# Altium schematic sheet OSD19001_USB.SchDoc
size B; Organization: Altium Limited; DocumentNumber: 4; SheetNumber: 4; SheetTotal: 4; SchematicTitle: OSD32MP1 BREAKOUT MODULE (USB)
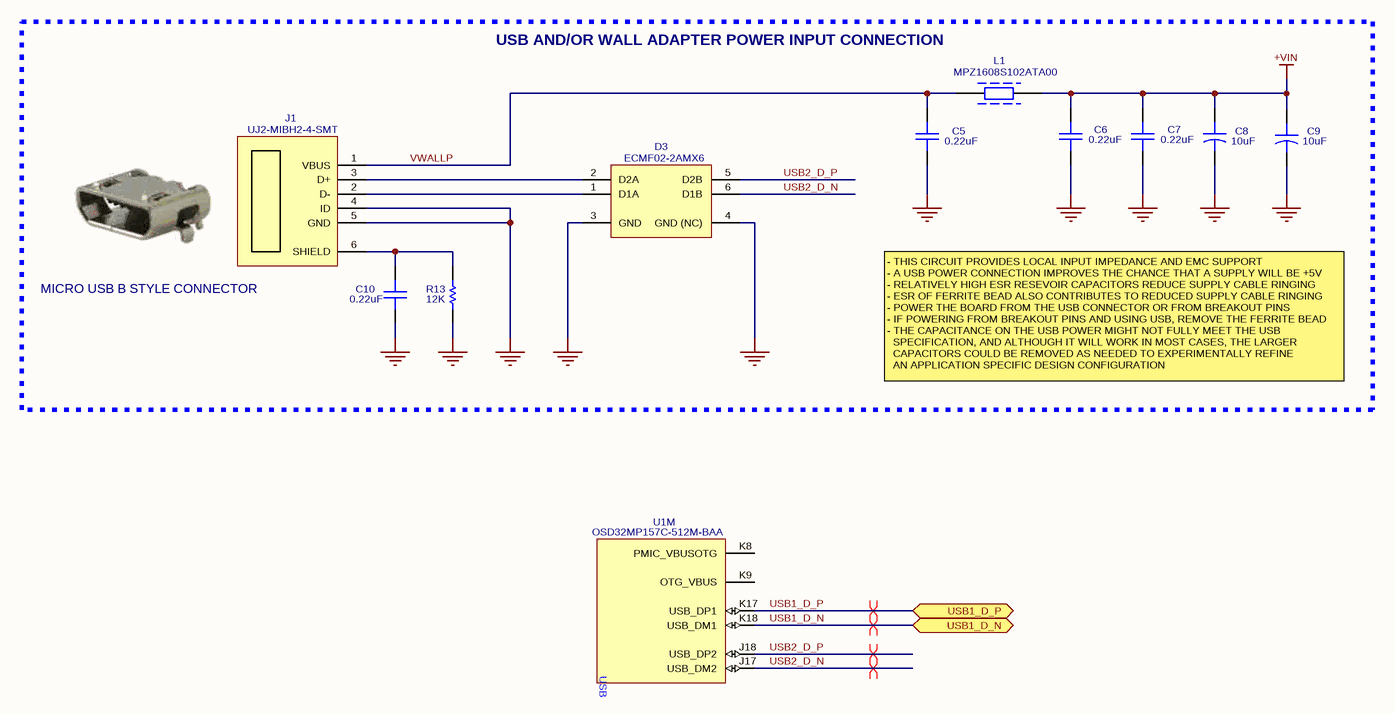
[diagram p0: OSD19001_USB.SchDoc]

## Parts
C5  0.22uF  [LP_0603_HIGH]
C6  0.22uF  [LP_0603_HIGH]
C7  0.22uF  [LP_0603_HIGH]
C8  10uF  [LP_EIAB]
C9  10uF  [LP_EIAB]
C10  0.22uF  [LP_0603_HIGH]
D3  ECMF02-2AMX6  [DFN6_6L_ST]
J1  UJ2-MIBH2-4-SMT  [CUI_UJ2-MIBH2-4-SMT]
L1  MPZ1608S102ATA00  [LP_0603_IND]
R13  12K  [LP_0603_LOW]
U1  OSD32MP157C-512M-BAA  [BGA_OCTAVO_SIP_OSD32MP157C]  (part M of 17)

## Blocks framed on the sheet
USB AND/OR WALL ADAPTER POWER INPUT CONNECTION: C5-C10 D3 J1 L1 R13

## Ports
USB1_D_N (bidir), USB1_D_P (bidir)

## Nets
+VIN: C6.2 C7.2 C8.1 C9.1 L1.2
GND: C5.1 C6.1 C7.1 C8.2 C9.2 C10.1 D3.3(GND) D3.4(GND_(NC)) J1.4(ID) J1.5(GND) R13.1
USB1_D_N: U1.K18(USB_DM1) ; port USB1_D_N
USB1_D_P: U1.K17(USB_DP1) ; port USB1_D_P
USB2_D_N: D3.6(D1B) U1.J17(USB_DM2)
USB2_D_P: D3.5(D2B) U1.J18(USB_DP2)
VWALLP: C5.2 J1.1(VBUS) L1.1
NetC10_2: C10.2 J1.6(SHIELD) R13.2
NetD3_1: D3.1(D1A) J1.2(D-)
NetD3_2: D3.2(D2A) J1.3(D+)

Not connected (* = marked no-connect by the designer): U1 K8(PMIC_VBUSOTG) K9(OTG_VBUS)

## Layout directives
differential pair: USB1_D_N, USB1_D_P, USB2_D_N, USB2_D_P

## Notes on the sheet
- MICRO USB B STYLE CONNECTOR
- - THIS CIRCUIT PROVIDES LOCAL INPUT IMPEDANCE AND EMC SUPPORT
  - A USB POWER CONNECTION IMPROVES THE CHANCE THAT A SUPPLY WILL BE +5V
  - RELATIVELY HIGH ESR RESEVOIR CAPACITORS REDUCE SUPPLY CABLE RINGING
  - ESR OF FERRITE BEAD ALSO CONTRIBUTES TO REDUCED SUPPLY CABLE RINGING
  - POWER THE BOARD FROM THE USB CONNECTOR OR FROM BREAKOUT PINS
  - IF POWERING FROM BREAKOUT PINS AND USING USB, REMOVE THE FERRITE BEAD
  - THE CAPACITANCE ON THE USB POWER MIGHT NOT FULLY MEET THE USB
  SPECIFICATION, AND ALTHOUGH IT WILL WORK IN MOST CASES, THE LARGER
  CAPACITORS COULD BE REMOVED AS NEEDED TO EXPERIMENTALLY REFINE
  AN APPLICATION SPECIFIC DESIGN CONFIGURATION
- TITLE:
- DRAWING:
- MODIFIED:
- REVISION:
- SHEET
- OF
- ALLIED COMPONENT WORKS
- CAD FILE:
- (in symbol OSD32MP157C, part M) USB

## Library data of the parts
C5-C7 C10 = CERCAP: Tolerance: 10%; Voltage: 25V; Value: 0.22uF
C8 C9 = POLCAP: Tolerance: 20%; Voltage: 10V; Value: 10uF
D3 = ECMF02-2AMX6: USB Filter And ESD Protection; PartNumber: ECMF02-2AMX6
J1 = USB_MICRO_B: USB Micro B Connetor; PartNumber: UJ2-MIBH2-4-SMT
L1 = BEAD: Impedence: 300; CurrentRating: 0.8A; PartNumber: MPZ1608S102ATA00; Size: 0603
R13 = RESISTOR: Tolerance: 5%; Power: 0.1W; Voltage: 50V; Value: 12K
U1 = OSD32MP157C: Octavo ST Processor SIP; Manufacturer: Octavo Systems; PartNumber: OSD32MP157C-512M-BAA; ComponentLink1Description: TBD; ComponentLink1URL: http://TBD